# EAGLE design kicker (EAGLE 6.1)
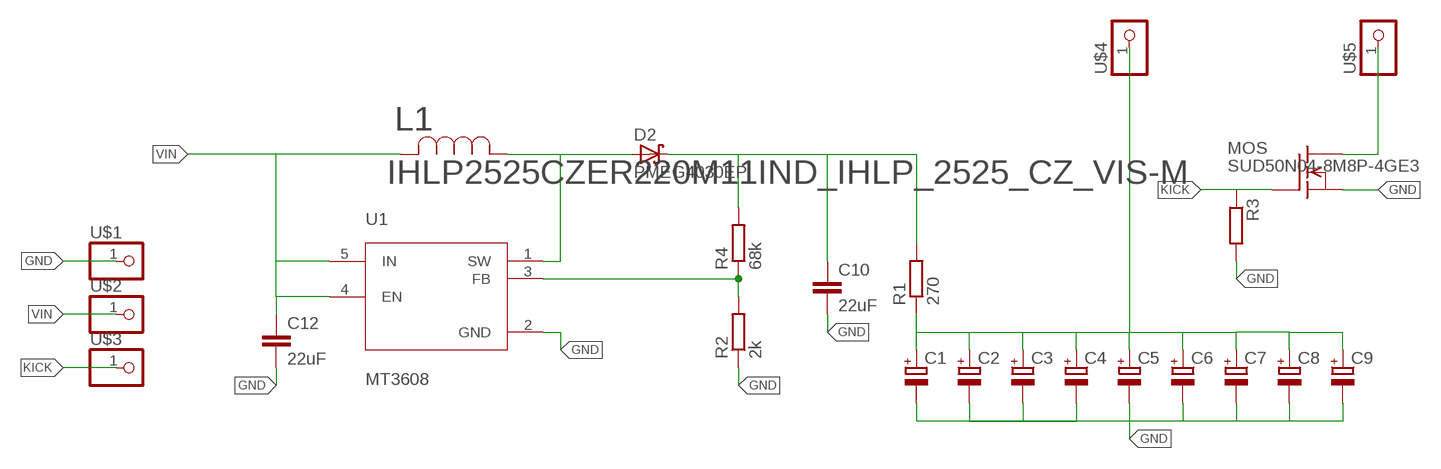
[diagram p0: schematic, sheet 1]

## Parts
C1  CPOL-EU153CLV-1010  [153CLV-1010]
C2  CPOL-EU153CLV-1010  [153CLV-1010]
C3  CPOL-EU153CLV-1010  [153CLV-1010]
C4  CPOL-EU153CLV-1010  [153CLV-1010]
C5  CPOL-EU153CLV-1010  [153CLV-1010]
C6  CPOL-EU153CLV-1010  [153CLV-1010]
C7  CPOL-EU153CLV-1010  [153CLV-1010]
C8  CPOL-EU153CLV-1010  [153CLV-1010]
C9  CPOL-EU153CLV-1010  [153CLV-1010]
C10  22uF  C-EUC0805  [C0805]
C12  22uF  C-EUC0805  [C0805]
D2  PMEG4030EP  [SOD128]
L1  IHLP2525CZER220M11IND_IHLP_2525_CZ_VIS-M  [IND_IHLP_2525_CZ_VIS-M]
MOS  SUD50N04-8M8P-4GE3  [TO252]
R1  270  R-EU_R2010  [R2010]
R2  2k  R-EU_M0805  [M0805]
R3  R-EU_M0805  [M0805]
R4  68k  R-EU_M0805  [M0805]
U1  MT3608  [SOT95P280X145-6N]
U$1  CONNEC_1X01PAD  [1_PAD]
U$2  CONNEC_1X01PAD  [1_PAD]
U$3  CONNEC_1X01PAD  [1_PAD]
U$4  CONNEC_1X01PAD  [1_PAD]
U$5  CONNEC_1X01PAD  [1_PAD]

## Nets
GND: C1.- C2.- C3.- C4.- C5.- C6.- C7.- C8.- C9.- C10.2 C12.2 MOS.2(S) R2.1 R3.2 U1.2(GND) U$1.1
KICK: MOS.1(G) R3.1 U$3.1
KICKER: MOS.3(D) U$5.1
N$1: D2.2(A) L1.1 U1.1(SW)
N$2: C10.1 D2.1(K) R1.2 R4.2
N$3: R2.2 R4.1 U1.3(FB)
VIN: C12.1 L1.2 U1.4(EN) U1.5(IN) U$2.1
VSTORE: C1.+ C2.+ C3.+ C4.+ C5.+ C6.+ C7.+ C8.+ C9.+ R1.1 U$4.1

## Library data of the parts
C1-C9 = rcl:CPOL-EU: POLARIZED CAPACITOR, European symbol; FARNELL: 2610827
C10 C12 = resistor:C-EU: CAPACITOR, European symbol; FARNELL: 2666560
D2 = nxp_60:PMEG4030E: 40 V, 3 A low VF MEGA Schottky barrier rectifier Planar Maximum Efficiency General Application (MEGA) Schottky barrier rectifier with an integrated guard ring for stress protection. AAL Eindhoven MK; FARNELL: 1829201
L1 = INDUCTOR:IHLP2525CZER220M11; BUILT_BY: EMA_UL_Team; FARNELL: 1741369; MANUFACTURER_PART_NUMBER: IHLP2525CZER220M11; SOURCELIBRARY: Vishay_2020-02-10; VENDOR: Vishay
MOS = rhoban:SUD50N04-8M8P-4GE3; FARNELL: 1794799
R1 = rcl:R-EU_: RESISTOR, European symbol; FARNELL: 1887603
R2 = resistor:R-EU_: RESISTOR, European symbol; FARNELL: MCWR08X2001FTL
R3 = resistor:R-EU_: RESISTOR, European symbol; FARNELL: 2447648
R4 = resistor:R-EU_: RESISTOR, European symbol; FARNELL: 2447023
U1 = MT3608:MT3608: High Efficiency 1.2MHz 2A Step Up Converter Check prices <https://pricing.snapeda.com/parts/MT3608/Aerosemi%20Technology%20Co.%2C%20Ltd/view-part?ref=eda>; AVAILABILITY: No availability data; DESCRIPTION: High Efficiency 1.2MHz 2A Step Up Converter; MF: Aerosemi Technology Co., Ltd; MP: MT3608; PACKAGE: Package; PRICE: None
U$1-U$5 = rhoban:CONNEC_1X01

## Board
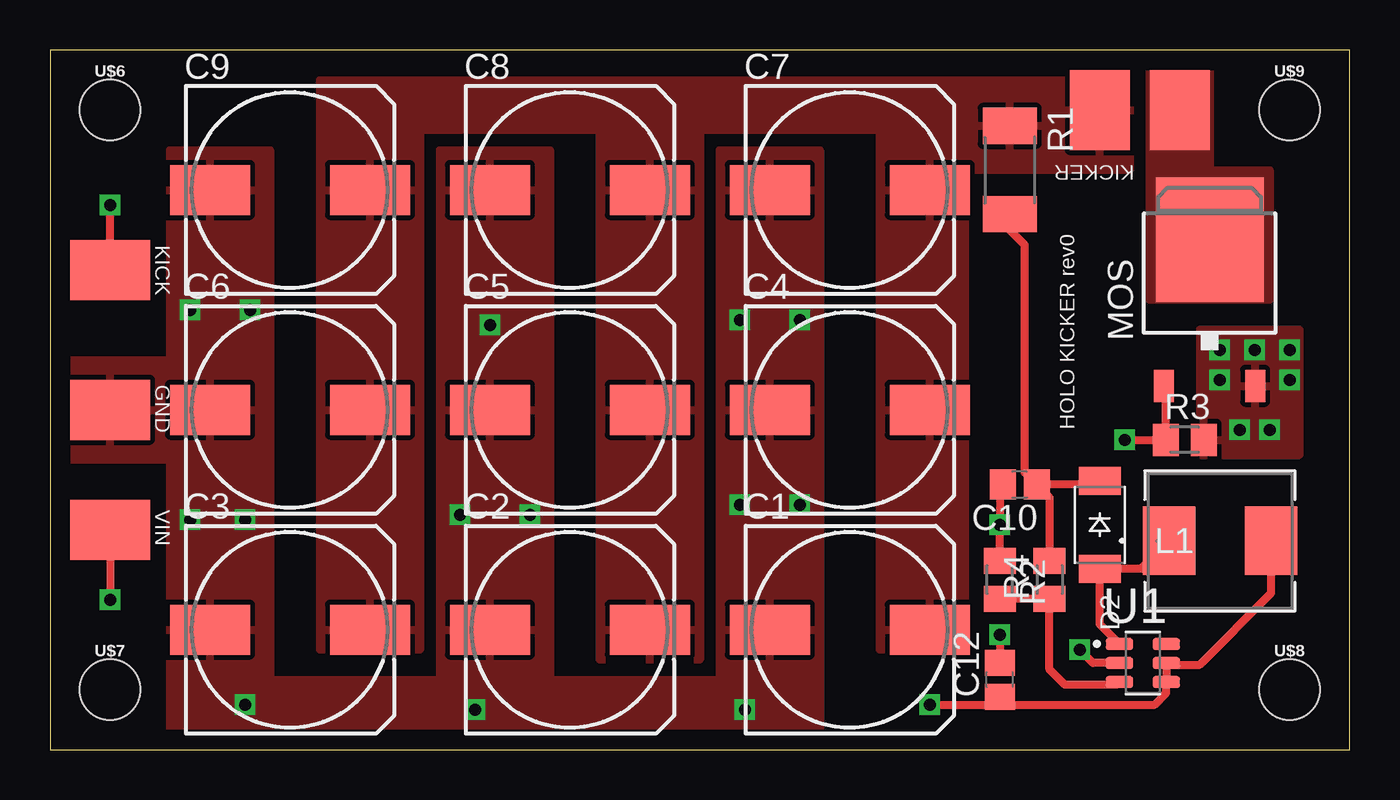
[diagram p1: board, top side]
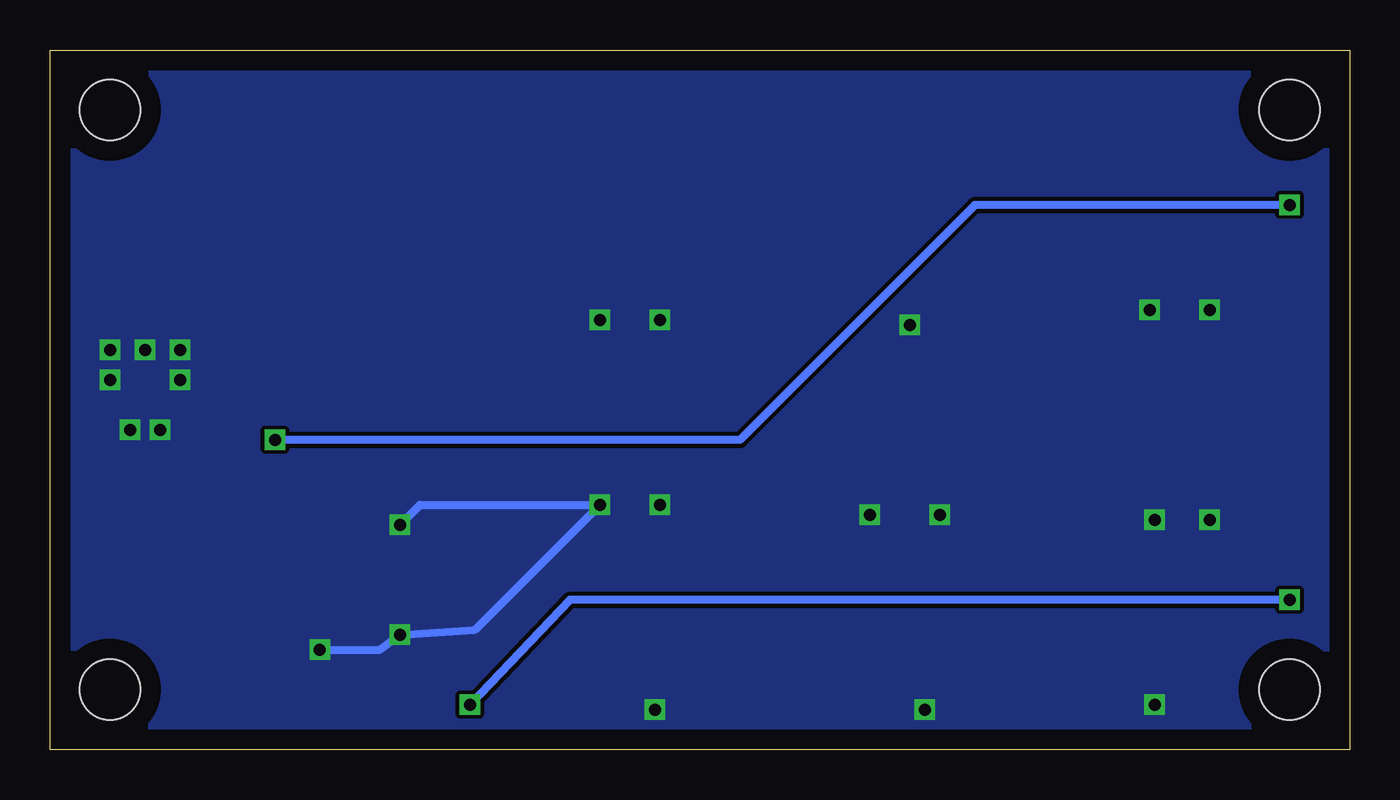
[diagram p2: board, bottom side, seen from below]

Size 65 x 35 mm. Coordinates in mm from the lower left corner, seen from the top.
Outline: 0,0 65,0 65,35 0,35 0,0
Copper layers (1*16): Top 0.035mm / dielectric 1.5mm / Bottom 0.035mm
Design rules: minimum track width 10mil, minimum drill 24mil, track to track 8mil, track to pad 8mil, pad to pad 8mil, via to via 8mil, smd to smd 8mil, copper to edge 40mil, drill to drill 8mil, minimum pad ring 10mil, minimum via ring 8mil, stop-mask expansion 4mil, vias tented up to drill 0mil, thermal gap 10mil

### Footprints (pad centres in the part's own frame; a part is rotated, then mirrored left to right if it is on the bottom)
153CLV-1010 = smd 4 x 2.5: + 4,0; - -4,0
C0805 = smd 1.3 x 1.5: 1 -0.85,0; 2 0.85,0
SOD128 = smd 1.4 x 2.1: 1 -2.2,0; 2 2.2,0
IND_IHLP_2525_CZ_VIS-M = smd 2.625 x 3.429: 1 -2.557,0; 2 2.557,0
TO252 = smd 1 x 1.6: 1 -2.28,-4.8; 2 2.28,-4.8 | smd 5.4 x 6.2: 3 0,2.5
R2010 = smd 1.8 x 2.7: 1 -2.2,0; 2 2.2,0
M0805 = smd 1.3 x 1.6: 1 -0.95,0; 2 0.95,0
SOT95P280X145-6N = smd 1.37 x 0.59: 1 -1.17,0.95; 2 -1.17,0; 3 -1.17,-0.95; 4 1.17,-0.95; 5 1.17,0; 6 1.17,0.95
1_PAD = smd 4 x 3: 1 0,0
STAND-OFF-TIGHT = hole 3.048: 0,0

### Placement (x,y rotation side)
C1  40,6 0 top
C2  26,6 0 top
C3  12,6 0 top
C4  40,17 0 top
C5  26,17 0 top
C6  12,17 0 top
C7  40,28 0 top
C8  26,28 0 top
C9  12,28 0 top
C10  48.5,13.25 180 top
C12  47.5,3.5 90 top
D2  52.5,11.25 270 top
L1  58.52,10.44 0 top
MOS  58,23 0 top
R1  48,29 270 top
R2  47.5,8.5 270 top
R3  56.75,15.5 0 top
R4  50,8.5 90 top
U1  54.66,4.33 0 top
U$1  3,17 0 top
U$2  3,11 0 top
U$3  3,24 0 top
U$4  52.5,32 90 top
U$5  56.5,32 90 top
U$6  [STAND-OFF-TIGHT]  3,32 0 top
U$7  [STAND-OFF-TIGHT]  3,3 0 top
U$8  [STAND-OFF-TIGHT]  62,3 0 top
U$9  [STAND-OFF-TIGHT]  62,32 0 top

### Tracks (layer width: path | path; a pad name or v marks a point on that pad's centre or on a via)
GND  (via drill 0.6)
  Top 0.406: C10.2 47.5,13.1 v47.5,11.25 R2.1 | R2.1 | U1.2 52.17,4.33 v51.5,5 | v47.5,5.75 C12.2
  Bottom 0.406: v47.5,11.25 46.5,12.25 v37.5,12.25 43.75,6 v47.5,5.75 48.5,5 v51.5,5
  other vias: 9.75,11.5 37.5,21.5 24,11.75 10,22 7,22 34.5,21.5 20.5,11.75 7,11.5 22,21.25 60.25,20 58.5,20 58.5,18.5 62,20 62,18.5 61,16 59.5,16 34.5,12.25 34.75,2 21.25,2 9.75,2.25
  pour Top: 6,19.5 6,30 11,30 11,3.5 19.5,3.5 19.5,30 25,30 25,3.5 33.5,3.5 33.5,30 38.5,30 38.5,1 6,1 6,14.5 0.5,14.5 0.5,19.5
  pour Bottom: 57.5,14.75 62.5,14.75 62.5,23.5 33.5,23.5 33.5,19.5 57.5,19.5
  pour Top: 57.5,14.75 62.5,14.75 62.5,21 57.5,21
  pour Bottom: -1.75,39.25 68.75,39.25 68.75,-4.75 -7.25,-4.75 -7.25,23.5
KICK  (via drill 0.6)
  Top 0.406: U$3.1 v3,27.25 | v53.75,15.5 R3.1 55.8,18.12 MOS.1
  Bottom 0.406: v3,27.25 18.75,27.25 30.5,15.5 v53.75,15.5
KICKER
  pour Top (no thermals): 55,34 58,34 58,29 61,29 61,22.5 55,22.5 55,32
N$1
  Top 0.406: L1.1 54.57,9.05 D2.2 52.5,6.27 U1.1
N$2
  Top 0.406: D2.1 52.3,13.25 C10.1 | C10.1 48.75,13.85 48.75,25.25 48,26 R1.2 | C10.1 50,12.6 R4.2
N$3
  Top 0.406: U1.3 53.36,3.25 50.75,3.25 50,4 R4.1 R2.2
VIN  (via drill 0.6)
  Top 0.406: U$2.1 v3,7.5 | v44,2.25 47.35,2.25 C12.1 48.15,2.25 55.25,2.25 55.83,2.83 U1.4 U1.5 55.91,4.25 57.5,4.25 61.08,7.83 L1.2
  Bottom 0.406: v3,7.5 39,7.5 v44,2.25
VSTORE
  pour Top: 13.5,5 13.5,33.5 45.75,33.5 45.75,5 41.5,5 41.5,31 32.5,31 32.5,4.5 27.5,4.5 27.5,31 18.5,31 18.5,5
  pour Top: 45,33.5 54,33.5 54,29 45,29 45,31.5

### Text on the board
_tsilk: KICKER | KICK | GND | HOLO KICKER rev0 | VIN